# Altium schematic sheet mbed_to_ccs.SchDoc
size Letter
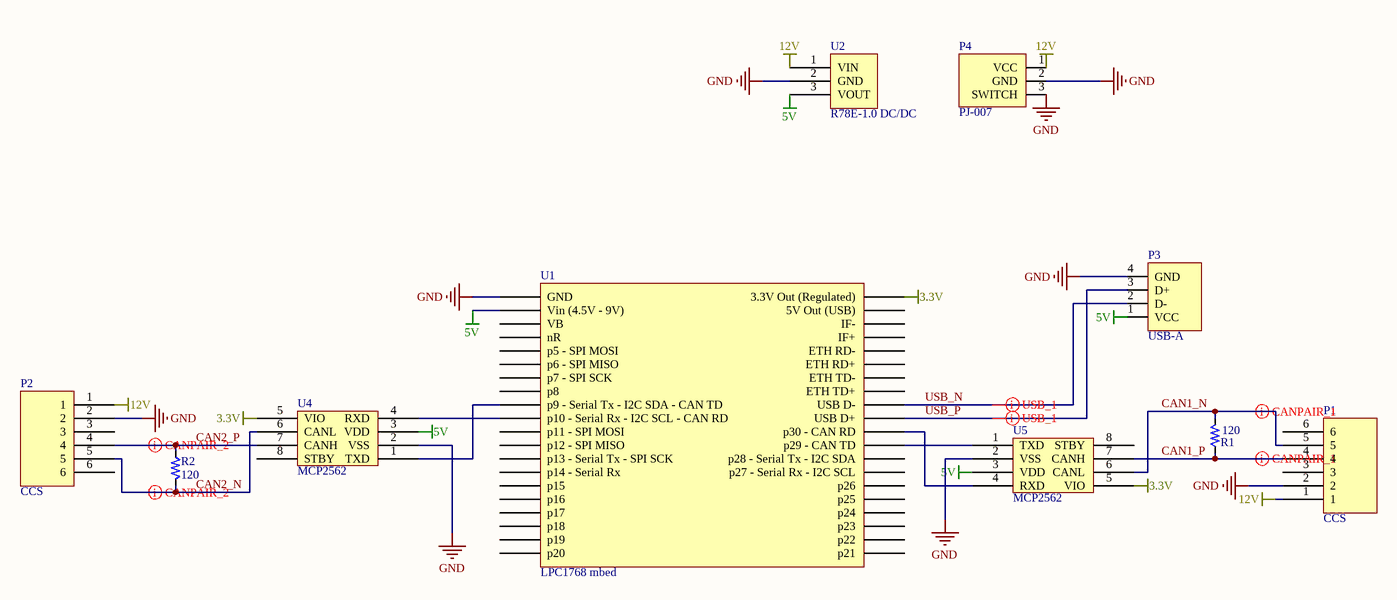
[diagram p0: mbed_to_ccs.SchDoc]

## Parts
P1  CCS  [PCB_MLX_MICROFIT_3X2]
P2  CCS  [PCB_MLX_MICROFIT_3X2]
P3  USB-A  [USB-A UE27AC54100 Receptacle]
P4  PJ-007  [BARREL JACK PJ007]
R1  120  [PCB_GENERIC_SMD_0603]
R2  120  [PCB_GENERIC_SMD_0603]
U1  LPC1768 mbed  [LPC 1768 mbed Layout]
U2  R78E-1.0 DC/DC  [R78-1.0]
U4  MCP2562  [MCP2562]
U5  MCP2562  [MCP2562]

## Nets
3.3V: U1.40(3.3V_Out_(Regulated)) U4.5(VIO) U5.5(VIO)
5V: P3.1(VCC) U1.2(Vin_(4.5V_-_9V)) U2.3(VOUT) U4.3(VDD) U5.3(VDD)
12V: P1.1 P2.1 P4.1(VCC) U2.1(VIN)
GND: P1.2 P2.2 P3.4(GND) P4.2(GND) P4.3(SWITCH) U1.1(GND) U2.2(GND) U4.2(VSS) U5.2(VSS)
CAN1_N: P1.5 R1.2 U5.6(CANL)
CAN1_P: P1.4 R1.1 U5.7(CANH)
CAN2_N: P2.5 R2.2 U4.6(CANL)
CAN2_P: P2.4 R2.1 U4.7(CANH)
USB_N: P3.2(D-) U1.32(USB_D-)
USB_P: P3.3(D+) U1.31(USB_D+)
NetU1_9: U1.9(p9_-_Serial_Tx_-_I2C_SDA_-_CAN_TD) U4.1(TXD)
NetU1_10: U1.10(p10_-_Serial_Rx_-_I2C_SCL_-_CAN_RD) U4.4(RXD)
NetU1_29: U1.29(p29_-_CAN_TD) U5.1(TXD)
NetU1_30: U1.30(p30_-_CAN_RD) U5.4(RXD)

Not connected (* = marked no-connect by the designer): P1 3 6; P2 3 6; U1 3(VB) 4(nR) 5(p5_-_SPI_MOSI) 6(p6_-_SPI_MISO) 7(p7_-_SPI_SCK) 8(p8) 11(p11_-_SPI_MOSI) 12(p12_-_SPI_MISO) 13(p13_-_Serial_Tx_-_SPI_SCK) 14(p14_-_Serial_Rx) 15(p15) 16(p16) 17(p17) 18(p18) 19(p19) 20(p20) 21(p21) 22(p22) 23(p23) 24(p24) 25(p25) 26(p26) 27(p27_-_Serial_Rx_-_I2C_SCL) 28(p28_-_Serial_Tx_-_I2C_SDA) 33(ETH_TD+) 34(ETH_TD-) 35(ETH_RD+) 36(ETH_RD-) 37(IF+) 38(IF-) 39(5V_Out_(USB)); U4 8(STBY); U5 8(STBY)

## Layout directives
differential pair: CAN1_N, CAN1_P, CAN2_N, CAN2_P, USB_N, USB_P

## Library data of the parts
P1 P2 = SCH_MLX_MICROFIT_3X2
P3 = USB-A UE27AC54100 Receptacle
P4 = Component_1
R1 R2 = SCH_GENERIC_RESISTOR_0603: 120 Ohms; Resistance: 120
U2 = R78E-1.0